# Altium schematic sheet LMX2592.SchDoc
size A; SheetNumber: 1; SheetTotal: 1
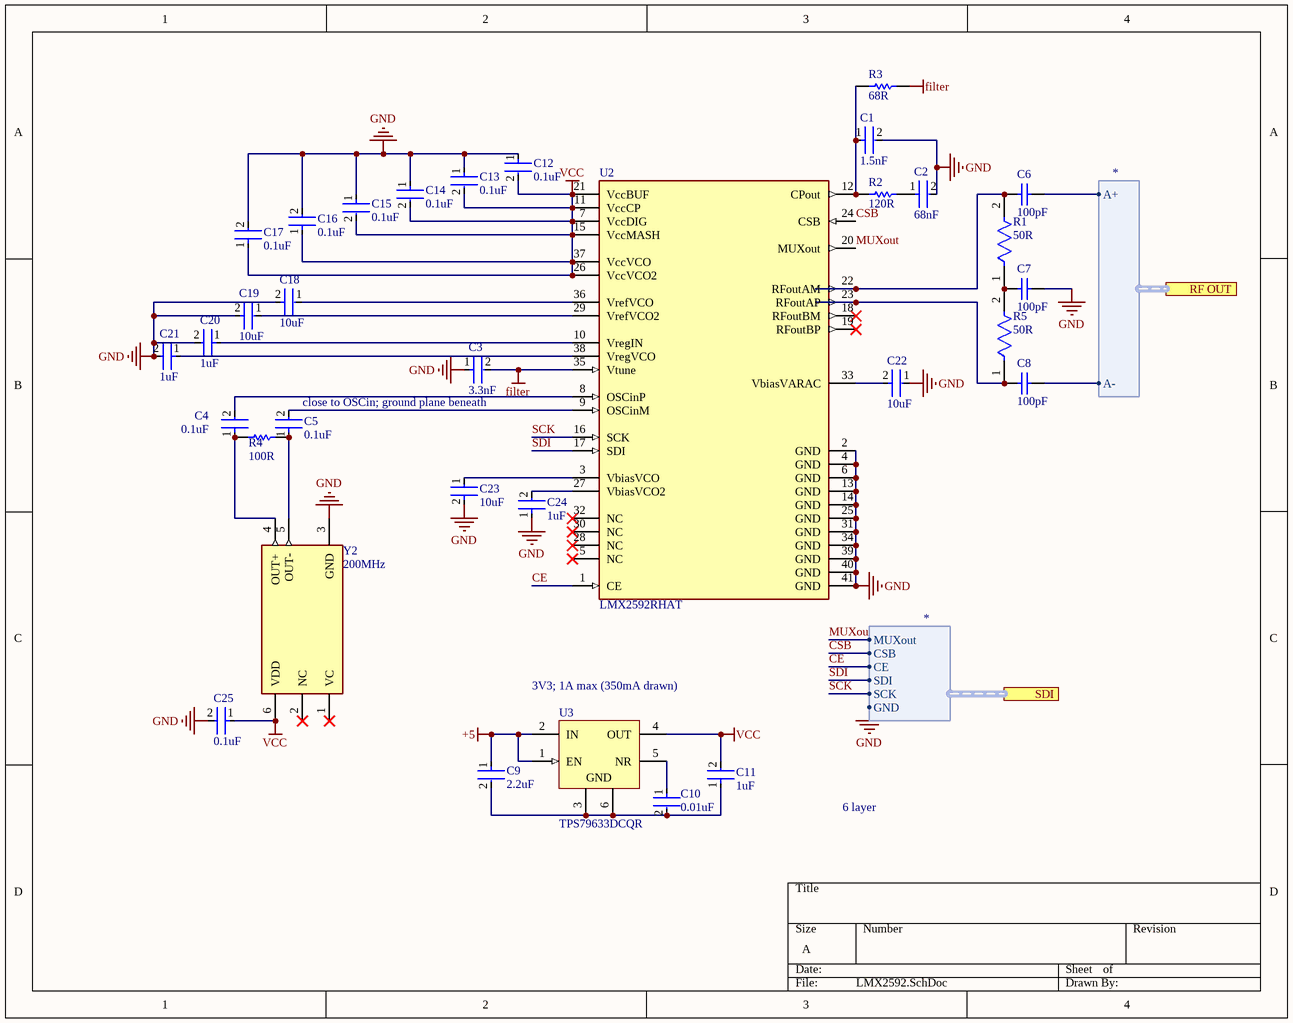
[diagram p0: LMX2592.SchDoc]

## Parts
C1  1.5nF  [FP-GRM188-0_1-e0_2_0_5-IPC_B]
C2  68nF  [FP-GRM319-0_15-MFG]
C3  3.3nF  [FP-GCM188-0_1-MFG]
C4  0.1uF  [FP-C0603C-CF-MFG]
C5  0.1uF  [FP-C0603C-CF-MFG]
C6  100pF  [CAPC1608X90X35NL10T15]
C7  100pF  [CAPC1608X90X35NL10T15]
C8  100pF  [CAPC1608X90X35NL10T15]
C9  2.2uF  [FP-GRM188-0_1-e0_2_0_5-MFG]
C10  0.01uF  [FP-C0603C-CF-MFG]
C11  1uF  [FP-0603-L_1_6_0_15-W_0_8-IPC_C]
C12  0.1uF  [FP-C0603C-CF-MFG]
C13  0.1uF  [FP-C0603C-CF-MFG]
C14  0.1uF  [FP-C0603C-CF-MFG]
C15  0.1uF  [FP-C0603C-CF-MFG]
C16  0.1uF  [FP-C0603C-CF-MFG]
C17  0.1uF  [FP-C0603C-CF-MFG]
C18  10uF  [FP-CL21B106KOQNNNE-MFG]
C19  10uF  [FP-CL21B106KOQNNNE-MFG]
C20  1uF  [FP-0603-L_1_6_0_15-W_0_8-IPC_C]
C21  1uF  [FP-0603-L_1_6_0_15-W_0_8-IPC_C]
C22  10uF  [FP-CL21B106KOQNNNE-MFG]
C23  10uF  [FP-CL21B106KOQNNNE-MFG]
C24  1uF  [FP-0603-L_1_6_0_15-W_0_8-IPC_C]
C25  0.1uF  [FP-C0603C-CF-MFG]
R1  50R  [FP-CRCW0603-e3-MFG]
R2  120R  [RESC1608X55X25NL10T15]
R3  68R  [RESC1608X55X30ML15T15]
R4  100R  [RESC1609X50X30ML8T20]
R5  50R  [FP-CRCW0603-e3-MFG]
U2  LMX2592RHAT  [FP-RHA0040H-IPC_B]
U3  TPS79633DCQR  [DCQ0006A_L]
Y2  200MHz  [FP-SiT5021AI-MFG]

## Ports
RF OUT (harness *), SDI (harness *)

## Harnesses
*: MUXout, CSB, CE, SDI, SCK, GND
*: A+, A-

## Nets
+5: C9.1 U3.1(EN) U3.2(IN)
filter: C3.2 R3.2 U2.35(Vtune)
GND: C1.2 C2.2 C3.1 C7.2 C12.1 C13.1 C14.1 C15.1 C16.2 C17.2 C18.2 C19.2 C20.2 C21.2 C22.1 C23.2 C24.1 C25.2 U2.2(GND) U2.4(GND) U2.6(GND) U2.13(GND) U2.14(GND) U2.25(GND) U2.31(GND) U2.34(GND) U2.39(GND) U2.40(GND) U2.41(GND) Y2.3(GND) ; port SDI.GND
VCC: C11.2 C12.2 C13.2 C14.2 C15.2 C16.1 C17.1 C25.1 U2.7(VccDIG) U2.11(VccCP) U2.15(VccMASH) U2.21(VccBUF) U2.26(VccVCO2) U2.37(VccVCO) U3.4(OUT) Y2.6(VDD)
CE: U2.1(CE) ; port SDI.CE
CSB: U2.24(CSB) ; port SDI.CSB
MUXout: U2.20(MUXout) ; port SDI.MUXout
SCK: U2.16(SCK) ; port SDI.SCK
SDI: U2.17(SDI) ; port SDI.SDI
NetC1_1: C1.1 R2.1 R3.1 U2.12(CPout)
NetC2_1: C2.1 R2.2
NetC4_1: C4.1 R4.1 Y2.4(OUT+)
NetC4_2: C4.2 U2.8(OSCinP)
NetC5_1: C5.1 R4.2 Y2.5(OUT-)
NetC5_2: C5.2 U2.9(OSCinM)
NetC6_1: C6.1 R1.2 U2.22(RFoutAM)
NetC6_2: C6.2 ; port RF OUT.A+
NetC7_1: C7.1 R1.1 R5.2
NetC8_1: C8.1 R5.1 U2.23(RFoutAP)
NetC8_2: C8.2 ; port RF OUT.A-
NetC9_2: C9.2 C10.2 C11.1 U3.3(GND) U3.6(GND)
NetC10_1: C10.1 U3.5(NR)
NetC18_1: C18.1 U2.36(VrefVCO)
NetC19_1: C19.1 U2.29(VrefVCO2)
NetC20_1: C20.1 U2.10(VregIN)
NetC21_1: C21.1 U2.38(VregVCO)
NetC22_2: C22.2 U2.33(VbiasVARAC)
NetC23_1: C23.1 U2.3(VbiasVCO)
NetC24_2: C24.2 U2.27(VbiasVCO2)

Not connected (* = marked no-connect by the designer): U2 5(NC)* 18(RFoutBM)* 19(RFoutBP)* 28(NC)* 30(NC)* 32(NC)*; Y2 1(VC)* 2(NC)*

## Notes on the sheet
- close to OSCin; ground plane beneath
- (near U3) 3V3; 1A max (350mA drawn)
- 6 layer

## Library data of the parts
C1 = CMP-06035-043535-1: Chip Multilayer Ceramic Capacitors for General Purpose, 0603, 1500pF, C0G, 30ppm/°C, 5%, 50V; Insulation Resistance: 10GR; Lead Free: Lead Free; REACH SVHC: No SVHC; Dielectric: C0G; Package Quantity: 1; Case/Package: 0603; Material: Ceramic; Height: 0.8mm; Length: 1.6mm; Max Operating Temperature: 125°C; Thickness: 0.035inch; Mount: Surface Mount; Depth: 0.8mm; Case Code (Metric): 1608; Dielectric Material: Ceramic; Radiation Hardening: No; Capacitance: 1.5nF; Termination: SMD/SMT; Tolerance: 5%; Number of Pins: 2; Temperature Coefficient: 30ppm/°C; Packaging: Tape and Reel; Width: 0.8mm; Voltage: 50V; Case Code (Imperial): 0603; Voltage Rating: 50V; Voltage Rating (DC): 50V; Min Operating Temperature: -55°C
C2 = CMP-06035-047801-1: Chip Multilayer Ceramic Capacitors for General Purpose, 1206, 68000pF, C0G, 30ppm/°C, 5%, 50V
C3 = CMP-06035-044585-1: Ceramic Capacitor for Automotive 3.3nF  ±1% 50VDC C0G 0603 Paper T/R
C4 C5 C12-C17 C25 = CMP-2006-03061-2: CAP CER 0.1UF 50V X7R 0603; Manufacturer: KEMET; Manufacturer Part Number: C0603C104K5RACTU; Tolerance: 0.1; Temperature Coefficient: 30ppm/°C; Material: Ceramic; Automotive Grade: Grade 1; Value: 0.10 μF; Temperature: -55°C to +125°C; RoHS: TRUE; Temperature Range High: +125°C; Lead Free: Yes; Octopart: https://octopart.com/c0603c104k5ractu-kemet-139244; Digikey Description: CAP CER 0.1UF 50V X7R 0603; Category: Cap; Package: C0603C-CF; ComponentLink2Description: Datasheet; Temperature Range Low: -55°C; Device Class L1: Passive Components; Voltage Rating: 50 V; Automotive: Yes; Device Class L3: Ceramic Capacitors; ComponentLink2URL: https://api.kemet.com/component-edge/download/datasheet/C0603C100J5GACAUTO.pdf; Capacitance: 0.10 μF; Device Class L2: Capacitors; Temperature Characteristic: X7R; Height: 0.87mm
C6-C8 = CMP-2006-02595-1: Part Number: GRM1885C1H101JA01D; Manufacturer: Murata
C9 = CMP-2006-02836-2: Chip Multilayer Ceramic Capacitors for General Purpose, 0603, 2.2uF, X7R, 15%, 10%, 10V; Case Code (Metric): 1608; Height: 0.8mm; Packaging: Cut Tape; Voltage: 10V; Lead Free: Lead Free; Min Operating Temperature: -55°C; Voltage Rating (DC): 10V; Max Operating Temperature: 125°C; Voltage Rating: 10V; Dielectric: X7R; Depth: 0.8mm; Case Code (Imperial): 0603; Termination: SMD/SMT; Case/Package: 0603; Number of Pins: 2; REACH SVHC: No SVHC; Mount: Surface Mount; Width: 0.031inch; Material: Ceramic; Capacitance: 2.2uF; Package Quantity: 1; Weight: 7.1E-05oz; Length: 1.6mm; Thickness: 0.035inch; Tolerance: 10%
C10 = CMP-2006-03046-3: CAP CER 10000PF 50V X7R 0603; Manufacturer: KEMET; Manufacturer Part Number: C0603C103K5RACTU; Temperature Coefficient: 30ppm/°C; Capacitance: 10,000 pF; Automotive Grade: Grade 1; Material: Ceramic; Value: 10,000 pF; Tolerance: 0.1; Voltage Rating: 50 V; Digikey Description: CAP CER 10000PF 50V X7R 0603; ComponentLink2Description: Datasheet; Mouser Description: Ceramic Capacitor 0.01Uf, 50V, X7R, 10%, 0603, Full Reel; ComponentLink2URL: https://api.kemet.com/component-edge/download/datasheet/C0603C100J5GACAUTO.pdf; Package: C0603C-CF; RoHS: TRUE; Octopart: https://octopart.com/c0603c103k5ractu-kemet-133094; Device Class L1: Passive Components; Temperature Range Low: -55°C; Automotive: Yes; Category: Cap; Lead Free: Yes; Temperature: -55°C to +125°C; Temperature Range High: +125°C; Temperature Characteristic: X7R; Height: 0.87mm; Device Class L3: Ceramic Capacitors; Device Class L2: Capacitors
C11 C20 C21 C24 = CMP-2000-07531-4: Ceramic Capacitor General Use 1uF ±10% 50V X7R 0603; Series: M; Width: 0.031inch; Mount: Surface Mount; Radiation Hardening: No; Voltage Rating (DC): 50V; Packaging: Tape and Reel; Termination: SMD/SMT; Depth: 0.8mm; Case Code (Metric): 1608; Case Code (Imperial): 0603; Height: 0.8mm; Voltage Rating: 50V; Package Quantity: 1; Halogen Free: Halogen Free; Dielectric: X7R; Min Operating Temperature: -55°C; Length: 1.6mm; Construction: Flat; Tolerance: 10%; Thickness: 0.037inch; Max Operating Temperature: 125°C; Case/Package: 0603; Capacitance: 1uF; RoHS Compliant: Yes
C18 C19 C22 C23 = CMP-2000-06106-2: CAP CER 10UF 16V X7R 0805; Manufacturer Part Number: CL21B106KOQNNNE; Manufacturer: Samsung Electro-Mechanics America, Inc; Material: Ceramic; Tolerance: 10%; Temperature Coefficient: 15%; Digikey Description: CAP CER 10UF 16V X7R 0805; Lead Free: Yes; ComponentLink2URL: http://www.samsungsem.com/servlet/FileDownload?path=productsearch&sname=CL21B106KOQNNNE.pdf&oname=CL21B106KOQNNNE.pdf; ComponentLink2Description: Datasheet; Temperature Range Low: -55°C; RoHS: TRUE; Category: Cap; Temperature Characteristic: X7R; Automotive: No; Octopart: https://octopart.com/cl21b106koqnnne-samsung-19832289; Device Class L3: Ceramic Capacitors; Temperature Range High: +125°C; Height: 1.4mm; Device Class L2: Capacitors; Voltage Rating: 16V; Value: 10uF; Temperature: -55°C to +125°C; Device Class L1: Passive Components; Ipc Land Pattern Name: CAPC200125X125; Package: CL21B106KOQNNNE; Capacitance: 10uF
R1 R5 = CMP-2000-03436-2: RES Thick Film, 50Ω, 1%, 0.1W, 100ppm/°C, 0603; Voltage Rating (DC): 75V; Power Rating: 100mW; Case/Package: 0603; Packaging: Tape and Reel; Military Standard: Not; REACH SVHC: No SVHC; Width: 0.85mm; Max Operating Temperature: 155°C; Case Code (Metric): 1608; Temperature Coefficient: 100ppm/°C; Lead Free: Lead Free; Height: 0.45mm; Composition: Thick Film; Termination: SMD/SMT; Contact Plating: Tin; Number of Pins: 2; Tolerance: 1%; Resistance: 50R; Depth: 0.85mm; Weight: 7.1E-05oz; Min Operating Temperature: -55°C; Length: 1.55mm; Radiation Hardening: No; Voltage Rating: 75V; Case Code (Imperial): 0603; Package Quantity: 5000; Mount: Surface Mount
R2 = CMP-1659-00034-1: Chip Resistor, 120 Ohm, +/- 1%, 100 mW, -55 to 155 degC, 0603 (1608 Metric), RoHS, Tape and Reel; Nominal Vf: 2.1 V; Power Rating: 90 mW; Case\Package: 0603; Lens Style: Diffused; Viewing Angle: 160 degrees; Forward Current: 20 mA; Luminous Intensity: 80 mcd; Illumination Colour: Orange; Nominal Wavelength: 606 nm; Package Quantity: 3000; Radiation Hardening: No; ComponentLink2URL: http://www.yageo.com/documents/recent/PYu-RC_Group_51_RoHS_L_04.pdf; Mount: Surface Mount; ComponentLink1URL: http://www.yageo.com/; PackageReference: 0603; PackageDescription: 2-Pin Surface Mount Device, Body 1.6 x 0.8 mm; Min Operating Temperature: -40 degC; Colour: Orange; Case Code (Metric): 1608; Length: 1.6 mm; Width: 0.8 mm; Packaging: Tape and Reel; Case Code (Imperial): 0603; RoHSCompliant: true; Height: 0.6 mm; DatasheetVersion: Rev. 4, 02/2016; Pins: 2; ComponentLink1Description: Manufacturer URL; Forward Voltage: 2.1 V; Max Operating Temperature: 100 degC; REACH SVHC: Unknown; ComponentLink2Description: Datasheet
R3 = CMP-2000-00818-1: Part Number: ERJ-3GEYJ680V; Manufacturer: Panasonic
R4 = CMP-2000-03824-5: Chip Resistor, 100 Ohm, +/- 1%, 100 mW,-55 to 155 degC, 0603 (1608 Metric), RoHS, Tape and Ree; Manufacturer: Vishay Semiconductor; ComponentLink2URL: http://www.vishay.com/docs/20035/dcrcwe3.pdf; ComponentLink1URL: http://www.vishay.com/; Mounting Technology: Surface Mount; ComponentLink1Description: Manufacturer URL; ComponentLink2Description: Datasheet; PackageDescription: 2-Pin Surface Mount Device, Body 1.575 x 0.85 mm; PackageReference: 0603; DatasheetVersion: 06/2012
U2 = CMP-04856-000019-1: IC PLL FREQ SYNTH W/VCO 40VQFN; Input: CMOS; Max Supply Voltage: 3.45V; Operating Supply Voltage: 3.3V; Number of Circuits: 1; Min Supply Voltage: 3.15V; Max Frequency: 9.8GHz; PLL: Yes; Case/Package: VQFN; Max Operating Temperature: 85°C; Mount: Surface Mount; Min Operating Temperature: -40°C; Number of Pins: 40; RoHS Compliant: Yes; REACH SVHC: No SVHC; Packaging: Cut Tape; Frequency: 9.8GHz; Lead Free: Lead Free
U3 = CMP-0395-00327-2: Single Output High PSRR LDO, 1 A, Fixed 3.3 V Output, 2.7 to 5.5 V Input, 6-pin SOT-223 (DCQ), -40 to 125 degC, Green (RoHS & no Sb/Br); Manufacturer: Texas Instruments; Accuracy(%): 2; Iout(Max)(A): 1; Vdo(Typ)(mV): 220; SubFamily: Single Channel LDO; Vout Adj(Min)(V): 3.3; Vin(Max)(V): 5.5; Iq(Typ)(mA): 0.26; Vin(Min)(V): 2.7; DatasheetVersion: SLVS351N; ComponentLink2Description: Datasheet; PartNumber: TPS79633DCQR; PackageDescription: 6-Pin Plastic Small Outline, Body 3.5 x 6.5 mm, Pitch 1.27 mm; ComponentLink1Description: Manufacturer URL; ComponentLink2URL: http://www.ti.com/general/docs/lit/getliterature.tsp?genericPartNumber=TPS79633&fileType=pdf; ComponentLink3URL: http://www.ti.com/litv/pdf/mpds098c; Mounting Technology: Surface Mount; Fixed Output Options(V): 3.3; PackageReference: DCQ0006A; ComponentLink1URL: http://www.ti.com/; PackageVersion: 4202109/D; ComponentLink3Description: Package Specification; Vout Adj(Max)(V): 3.3; Eco-Plan: Green (RoHS & no Sb/Br)
Y2 = CMP-25159-261274-1: MEMS OSC VCTCXO 200.0000MHZ LVDS; Frequency Stability: 5ppm; Max Supply Current: 55mA; Case/Package: SMD/SMT; Packaging: Tape and Reel; Min Operating Temperature: -40°C; RoHS Compliant: Yes; Frequency: 200MHz; Mount: Surface Mount; Max Operating Temperature: 85°C